# Altium schematic sheet MCU.SchDoc
size A
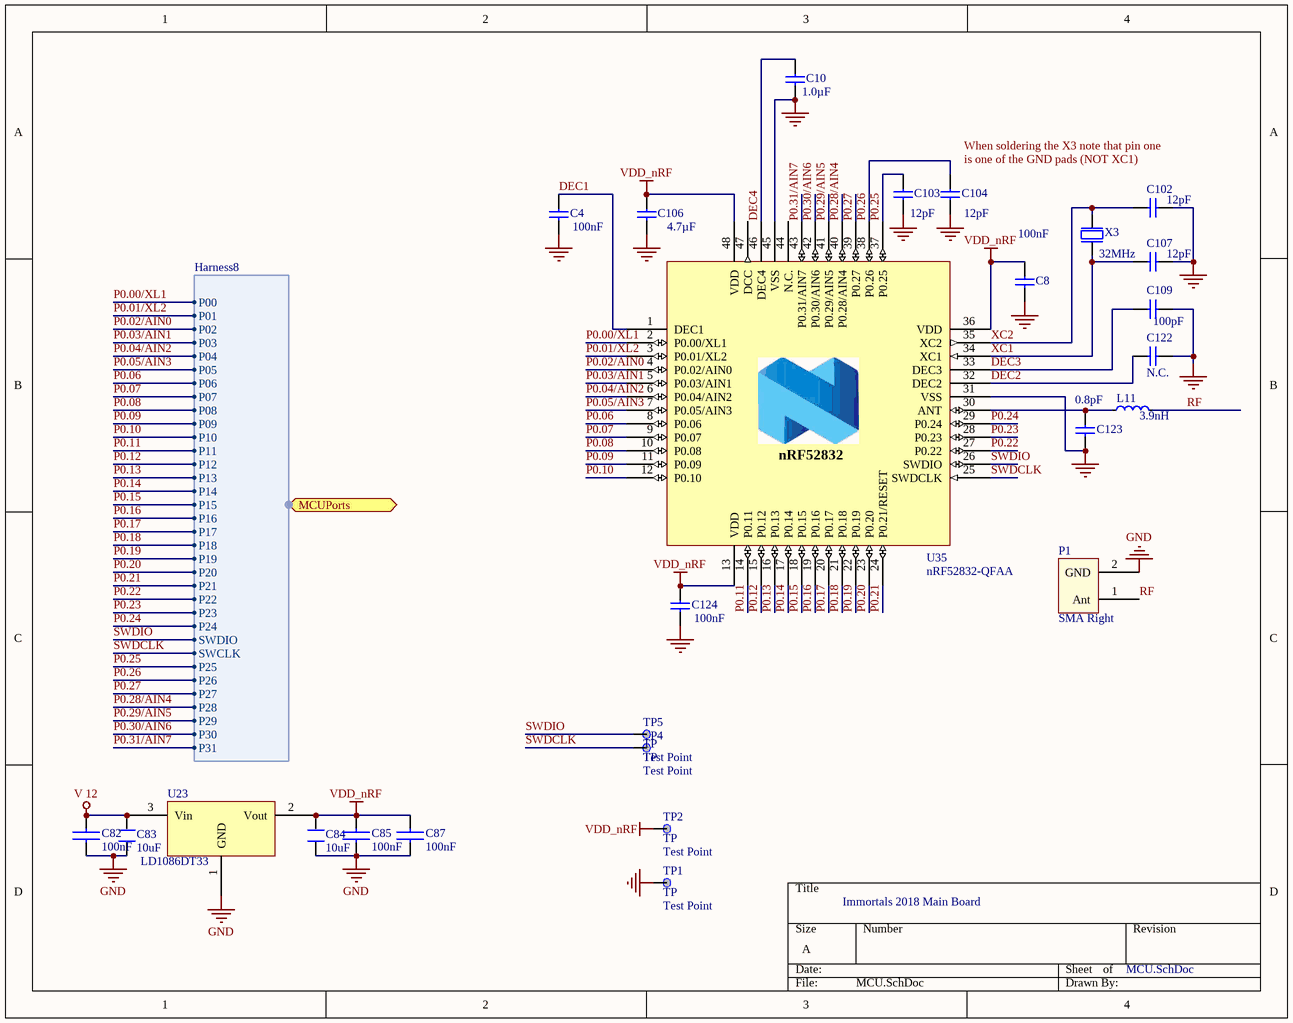
[diagram p0: MCU.SchDoc]

## Parts
C4  value 100nF  [CAPC1005X04L]  (hidden comment: Cap 100nF 0402)
C8  value 100nF  [CAPC1005X04L]  (hidden comment: Cap 100nF 0402)
C10  value 1.0µF  [CAPC1608X06L]  (hidden comment: Cap 1uF 0603)
C82  value 100nF  [C0603]  (hidden comment: Cap 100nF 0603)
C83  value 10uF  [C1206]  (hidden comment: Cap 10uF 1206)
C84  value 10uF  [C1206]  (hidden comment: Cap 10uF 1206)
C85  value 100nF  [C0603]  (hidden comment: Cap 100nF 0603)
C87  value 100nF  [C0603]  (hidden comment: Cap 100nF 0603)
C102  value 12pF  [CAPC1005X04L]  (hidden comment: Cap 12pF 0402)
C103  value 12pF  [CAPC1005X04L]  (hidden comment: Cap 12pF 0402)
C104  value 12pF  [CAPC1005X04L]  (hidden comment: Cap 12pF 0402)
C106  value 4.7µF  [CAPC1608X06L]  (hidden comment: Cap 4.7uF 0603)
C107  value 12pF  [CAPC1005X04L]  (hidden comment: Cap 12pF 0402)
C109  value 100pF  [CAPC1005X04L]  (hidden comment: Cap 100pF 0402)
C122  N.C.  [CAPC1005X04L]
C123  value 0.8pF  [CAPC1005X04L]  (hidden comment: Cap 0.8pF 0402)
C124  value 100nF  [CAPC1005X04L]  (hidden comment: Cap 100nF 0402)
L11  value 3.9nH  [INDC1005X04L]  (hidden comment: Inductor 3.9nH 0402)
P1  SMA Right  [SMA Right]
TP1  TP  value Test Point  [TP]
TP2  TP  value Test Point  [TP]
TP4  TP  value Test Point  [TP]
TP5  TP  value Test Point  [TP]
U23  LD1086DT33  [DPAK]
U35  nRF52832-QFAA  [QFN40P600X600X90-48N]
X3  value 32MHz  [BT-XTAL_2016]  (hidden comment: XTAL 32MHz)

## Ports
MCUPorts (harness Harness8)

## Harnesses
Harness8: P02, P03, P04, P05, P06, P07, P08, P09, P10, P11, P12, P13, P14, P15, P16, P17, P18, P19, P20, P21, P24, P23, P22, SWDIO, SWCLK, P25, P26, P27, P28, P29, P30, P31, P01, P00

## Nets
GND: C4.2 C8.2 C10.1 C82.1 C83.1 C84.1 C85.1 C87.1 C102.2 C103.2 C104.2 C106.2 C107.2 C109.2 C122.1 C123.1 C124.2 P1.2(GND) TP1.1 U23.1(GND) U35.31(VSS) U35.45(VSS) U35.49(GND) X3.2(GND) X3.4(GND)
V 12: C82.2 C83.2 U23.3(Vin)
VDD_nRF: C8.1 C84.2 C85.2 C87.2 C106.1 C124.1 TP2.1 U23.2(Vout) U35.13(VDD) U35.36(VDD) U35.48(VDD)
DEC1: C4.1 U35.1(DEC1)
DEC2: C122.2 U35.32(DEC2)
DEC3: C109.1 U35.33(DEC3)
DEC4: C10.2 U35.46(DEC4)
P0.00/XL1: U35.2(P0.00/XL1) ; port MCUPorts.P00
P0.01/XL2: U35.3(P0.01/XL2) ; port MCUPorts.P01
P0.02/AIN0: U35.4(P0.02/AIN0) ; port MCUPorts.P02
P0.03/AIN1: U35.5(P0.03/AIN1) ; port MCUPorts.P03
P0.04/AIN2: U35.6(P0.04/AIN2) ; port MCUPorts.P04
P0.05/AIN3: U35.7(P0.05/AIN3) ; port MCUPorts.P05
P0.06: U35.8(P0.06) ; port MCUPorts.P06
P0.07: U35.9(P0.07) ; port MCUPorts.P07
P0.08: U35.10(P0.08) ; port MCUPorts.P08
P0.09: U35.11(P0.09) ; port MCUPorts.P09
P0.10: U35.12(P0.10) ; port MCUPorts.P10
P0.11: U35.14(P0.11) ; port MCUPorts.P11
P0.12: U35.15(P0.12) ; port MCUPorts.P12
P0.13: U35.16(P0.13) ; port MCUPorts.P13
P0.14: U35.17(P0.14) ; port MCUPorts.P14
P0.15: U35.18(P0.15) ; port MCUPorts.P15
P0.16: U35.19(P0.16) ; port MCUPorts.P16
P0.17: U35.20(P0.17) ; port MCUPorts.P17
P0.18: U35.21(P0.18) ; port MCUPorts.P18
P0.19: U35.22(P0.19) ; port MCUPorts.P19
P0.20: U35.23(P0.20) ; port MCUPorts.P20
P0.21: U35.24(P0.21/RESET) ; port MCUPorts.P21
P0.22: U35.27(P0.22) ; port MCUPorts.P22
P0.23: U35.28(P0.23) ; port MCUPorts.P23
P0.24: U35.29(P0.24) ; port MCUPorts.P24
P0.25: C103.1 U35.37(P0.25) ; port MCUPorts.P25
P0.26: C104.1 U35.38(P0.26) ; port MCUPorts.P26
P0.27: U35.39(P0.27) ; port MCUPorts.P27
P0.28/AIN4: U35.40(P0.28/AIN4) ; port MCUPorts.P28
P0.29/AIN5: U35.41(P0.29/AIN5) ; port MCUPorts.P29
P0.30/AIN6: U35.42(P0.30/AIN6) ; port MCUPorts.P30
P0.31/AIN7: U35.43(P0.31/AIN7) ; port MCUPorts.P31
RF: L11.2 P1.1(Ant)
SWDCLK: TP4.1 U35.25(SWDCLK) ; port MCUPorts.SWCLK
SWDIO: TP5.1 U35.26(SWDIO) ; port MCUPorts.SWDIO
XC1: C107.1 U35.34(XC1) X3.1(inp)
XC2: C102.1 U35.35(XC2) X3.3(out)
NetC123_2: C123.2 L11.1 U35.30(ANT)

Not connected (* = marked no-connect by the designer): U35 44(N.C.) 47(DCC)

## Notes on the sheet
- When soldering the X3 note that pin one
- is one of the GND pads (NOT XC1)
- Immortals 2018 Main Board
- (in symbol nRF52832-QFAA) nRF52832

## Library data of the parts
C4 C8 C124 = C0402-100n: Capacitor, X7R, ±10%; Note: 16V; Artikkelnr Noca: 20039200; Artikkelnr Simpro: N.A.; Part Number: C0402-100n; Manufacturer: *; Manufacturer Part Number: *; Datasheet: *; LatestRevisionDate: 2009-11-23; Pin Count: 2; Publisher: Nordic Semiconductor; Published: 2009-05-08; Supplier: *; Supplier part number: *; 2nd source Supplier: *; 2nd source part number: *; Footprint Doc: 0402
C10 = C0603-1µ0: Capacitor, X7R, ±10%; Note: 16V; Artikkelnr Noca: 20039335; Artikkelnr Simpro: N.A.; Part Number: C0603-1µ0; Manufacturer: *; Manufacturer Part Number: *; Datasheet: *; LatestRevisionDate: 2013-06-05; Pin Count: 2; Publisher: Nordic Semiconductor; Published: 2009-05-08; Supplier: *; Supplier part number: *; 2nd source Supplier: *; 2nd source part number: *; Footprint Doc: 0603
C82 C85 C87 = C0603
C83 C84 = C1206: Part Field 1: 2064
C102-C104 C107 = C0402-12p: Capacitor, NP0, ±2%; Note: 50V; Artikkelnr Noca: 20029159; Artikkelnr Simpro: N.A.; Part Number: C0402-12p; Manufacturer: *; Manufacturer Part Number: *; Datasheet: *; LatestRevisionDate: 2011-05-11; Pin Count: 2; Publisher: Nordic Semiconductor; Published: 2009-05-08; Supplier: *; Supplier part number: *; 2nd source Supplier: *; 2nd source part number: *; Footprint Doc: 0402
C106 = C0603-4µ7: Capacitor, X5R, ±10%; Note: 6.3V; Artikkelnr Noca: 20069060; Artikkelnr Simpro: N.A.; Part Number: C0603-4µ7; Manufacturer: *; Manufacturer Part Number: *; Datasheet: *; LatestRevisionDate: 2009-11-23; Pin Count: 2; Publisher: Nordic Semiconductor; Published: 2009-05-08; Supplier: *; Supplier part number: *; 2nd source Supplier: *; 2nd source part number: *; Footprint Doc: 0603
C109 = C0402-100p: Capacitor, NP0, ±5%; Note: 50V; Artikkelnr Noca: 20029135; Artikkelnr Simpro: N.A.; Part Number: C0402-100p; Manufacturer: *; Manufacturer Part Number: *; Datasheet: *; LatestRevisionDate: 2009-05-08; Pin Count: 2; Publisher: Nordic Semiconductor; Published: 2009-05-08; Supplier: *; Supplier part number: *; 2nd source Supplier: *; 2nd source part number: *; Footprint Doc: 0402
C122 = C0402-N.C.: Not mounted; Note: Chip Cap; Artikkelnr Noca: N.A.; Part Number: C0402-N.C.; Manufacturer: *; Manufacturer Part Number: *; Datasheet: *; LatestRevisionDate: 2009-05-08; Pin Count: 2; Publisher: Nordic Semiconductor; Published: 2009-05-08; Value: N.C.; Supplier: *; Supplier part number: *; 2nd source Supplier: *; 2nd source part number: *; Footprint Doc: 0402; Artikkelnr Simpro: N.A.
C123 = C0402-0.8p: Capacitor, NP0, ±5%; Note: 50V; Artikkelnr Noca: 20029147; Artikkelnr Simpro: N.A.; Part Number: C0402-0.8p; Manufacturer: *; Manufacturer Part Number: *; Datasheet: *; LatestRevisionDate: 2012-11-21; Pin Count: 2; Publisher: Nordic Semiconductor; Published: 2009-05-08; Supplier: *; Supplier part number: *; 2nd source Supplier: *; 2nd source part number: *; Footprint Doc: 0402
L11 = L0402-3n9: High frequency chip inductor ±5%; Manufacturer: Murata; Manufacturer Part Number: LQP15MN3N9B02D; Artikkelnr Noca: 33029151; Artikkelnr Simpro: N.A.; Part Number: L0402-3n9; Datasheet: http://search.murata.co.jp/Ceramy/image/img/PDF/ENG/L0075S0084LQP15M.pdf; LatestRevisionDate: 2012-09-19; Pin Count: 2; Publisher: Nordic Semiconductor; Published: 2009-05-08; Note: High frequency chip inductor ±5%; Supplier: Digi-Key; Supplier part number: 490-1131-1-ND; 2nd source Supplier: *; 2nd source part number: *; Footprint Doc: 0402
TP1 TP2 TP4 TP5 = TP: Test Point
U23 = LD1086: LD1086DT33 DPAK; Output: 3.3V; Value: LD1086DT33
U35 = nRF52832-QFAA: Multi-protocol Bluetooth Low Energy, ANT and 2.4GHz proprietary system-on-chip; Manufacturer: Nordic Semiconductor; Artikkelnr Noca: N.A.; Part Number: nRF52832-QFAA; Manufacturer Part Number: nRF52832-QFAA; Datasheet: *; LatestRevisionDate: 2014-11-26; Pin Count: 48; Publisher: Nordic Semiconductor; Published: 2014-11-26; Value: nRF52832-QFAA; Note: *; Supplier: Nordic Semiconductor; Supplier part number: *; 2nd source Supplier: *; 2nd source part number: *; Footprint Doc: QFN-48; Artikkelnr Simpro: N.A.
X3 = XTAL_SMD2016_32MHz_8pF_General: XTAL SMD 2016, 32MHz, Cl=8pF, Total Tol: ±40ppm; Note: XTAL SMD 32.000MHz; Artikkelnr Noca: N.A.; Part Number: XTAL_SMD2016_32MHz_8pF_General; Manufacturer: *; Manufacturer Part Number: *; Datasheet: *; LatestRevisionDate: 2016-08-19; Pin Count: 4; Publisher: Nordic Semiconductor; Published: 2016-08-19; Supplier: *; Supplier part number: *; 2nd source Supplier: *; 2nd source part number: *; Footprint Doc: XTAL_2016; Artikkelnr Simpro: N.A.